# EAGLE schematic Prototype_schematic (EAGLE 7.5.0)
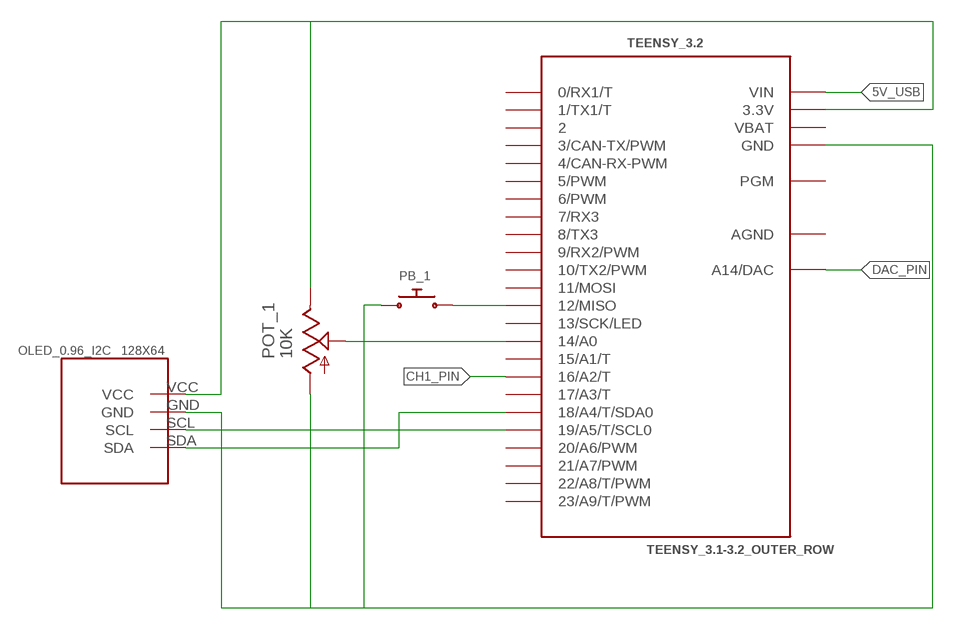
[diagram p0: schematic, sheet 1]

## Parts
128X64  OLED_0.96_I2C  [OLED_0.96_I2C]
PB_1  PUSH_BUTTON_RCTNG  [PB_DIP_RCTNG_3-WIDE]
POT_1  10K  POTENTIOMETER  [POTENTIOMETER]
TEENSY_3.2  TEENSY_3.1-3.2_OUTER_ROW  [TEENSY_3.0-3.2&LC_OUTER_ROW]

## Nets
5V_USB: TEENSY_3.2.VIN
CH1_PIN: TEENSY_3.2.16/A2(16/A2/T)
DAC_PIN: TEENSY_3.2.RESET/DAC(A14/DAC)
N$2: 128X64.SCL TEENSY_3.2.19/A5(19/A5/T/SCL0)
N$3: 128X64.SDA TEENSY_3.2.18/A4(18/A4/T/SDA0)
N$7: PB_1.2 TEENSY_3.2.12(12/MISO)
N$8: 128X64.GND PB_1.1 POT_1.+(-) TEENSY_3.2.GND TEENSY_3.2.GND1(GND)
N$9: 128X64.VCC POT_1.-(+) TEENSY_3.2.3.3V TEENSY_3.2.3.3V1(3.3V)
N$10: POT_1.DATA TEENSY_3.2.14/A0
Unconnected: TEENSY_3.2.0(0/RX1/T) TEENSY_3.2.1(1/TX1/T) TEENSY_3.2.2 TEENSY_3.2.3(3/CAN-TX/PWM) TEENSY_3.2.4(4/CAN-RX-PWM) TEENSY_3.2.5(5/PWM) TEENSY_3.2.6(6/PWM) TEENSY_3.2.7(7/RX3) TEENSY_3.2.8(8/TX3) TEENSY_3.2.9(9/RX2/PWM) TEENSY_3.2.10(10/TX2/PWM) TEENSY_3.2.11(11/MOSI) TEENSY_3.2.13(13/SCK/LED) TEENSY_3.2.15/A1(15/A1/T) TEENSY_3.2.17/A3(17/A3/T) TEENSY_3.2.20/A6(20/A6/PWM) TEENSY_3.2.21/A7(21/A7/PWM) TEENSY_3.2.22/A8(22/A8/T/PWM) TEENSY_3.2.23/A9(23/A9/T/PWM) TEENSY_3.2.PGM

## Power pins joined to a net without a drawn wire
AGND: TEENSY_3.2.AGND
VBAT: TEENSY_3.2.VBAT

## Library data of the parts
128X64 = tft_1_8_1_44_oled_0_96:OLED_0.96_I2C
PB_1 = Generic:PUSH_BUTTON
POT_1 = Generic:POTENTIOMETER
TEENSY_3.2 = Teensy_3_and_LC_Series_Boards_v1.4:TEENSY_3.1-3.2_OUTER_ROW: Footprint for Teensy 3.1 or 3.2 board using all pin connections on the outer perimeter